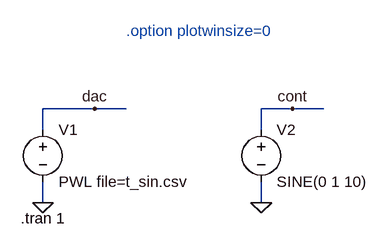
[diagram p0: schematic DAC_harmonics.asc]
DAC_harmonics.asc, the LTspice schematic file:
Version 4
SHEET 1 880 680
WIRE 176 80 96 80
WIRE 224 80 176 80
WIRE 480 80 432 80
WIRE 528 80 480 80
WIRE 96 112 96 80
WIRE 432 112 432 80
WIRE 96 224 96 192
WIRE 432 224 432 192
FLAG 96 224 0
FLAG 176 80 dac
FLAG 432 224 0
FLAG 480 80 cont
SYMBOL voltage 96 96 R0
WINDOW 123 0 0 Left 2
WINDOW 39 0 0 Left 2
SYMATTR InstName V1
SYMATTR Value PWL file=t_sin.csv
SYMBOL voltage 432 96 R0
WINDOW 123 0 0 Left 2
WINDOW 39 0 0 Left 2
SYMATTR InstName V2
SYMATTR Value SINE(0 1 10)
TEXT 62 248 Left 2 !.tran 1
TEXT 224 -40 Left 2 ;.option plotwinsize=0

The netlist it stands for:
* DAC_harmonics.asc
V1 dac 0 PWL file=t_sin.csv
V2 cont 0 SINE(0 1 10)
.tran 1
* .option plotwinsize=0
.backanno
.end